# Altium schematic sheet PROC010B_CAN Interface.SchDoc: CAN Interface
size 431 x 279 mm; Date: Not shown in title block; ApprovedBy: Not shown in title block; CheckedBy: Not shown in title block; Author: Not shown in title block; CompanyName: Not shown in title block; DrawnBy: Adrian Ozer; Engineer: Not shown in title block; Organization: Not shown in title block; Address1: Not shown in title block; Address2: Not shown in title block; Address3: Not shown in title block; Address4: Not shown in title block; DocumentNumber: 14; Revision: Use project parameter SCH_Rev; SheetNumber: 14; SheetTotal: 16; PageSetup: Record=PageOptions|CenterHorizontal=True|CenterVertical=True|PrintScale=1.00|XCorrection=1.00|YCorrection=1.00|PrintKind=0|BorderSize=5000000|LeftOffset=0|BottomOffset=0|Orientation=2|PaperLength=1000|PaperWidth=1000|Scale=100|PaperSource=15|PrintQuality=600|MediaType=1|DitherType=10|PaperKind=Letter|PrintScaleMode=1; CurrentTime: Not shown in title block; CurrentDate: Not shown in title block; Time: Not shown in title block; DocumentFullPathAndName: Not shown in title block; DocumentName: Not shown in title block; ModifiedDate: Not shown in title block; ImagePath: Not shown in title block
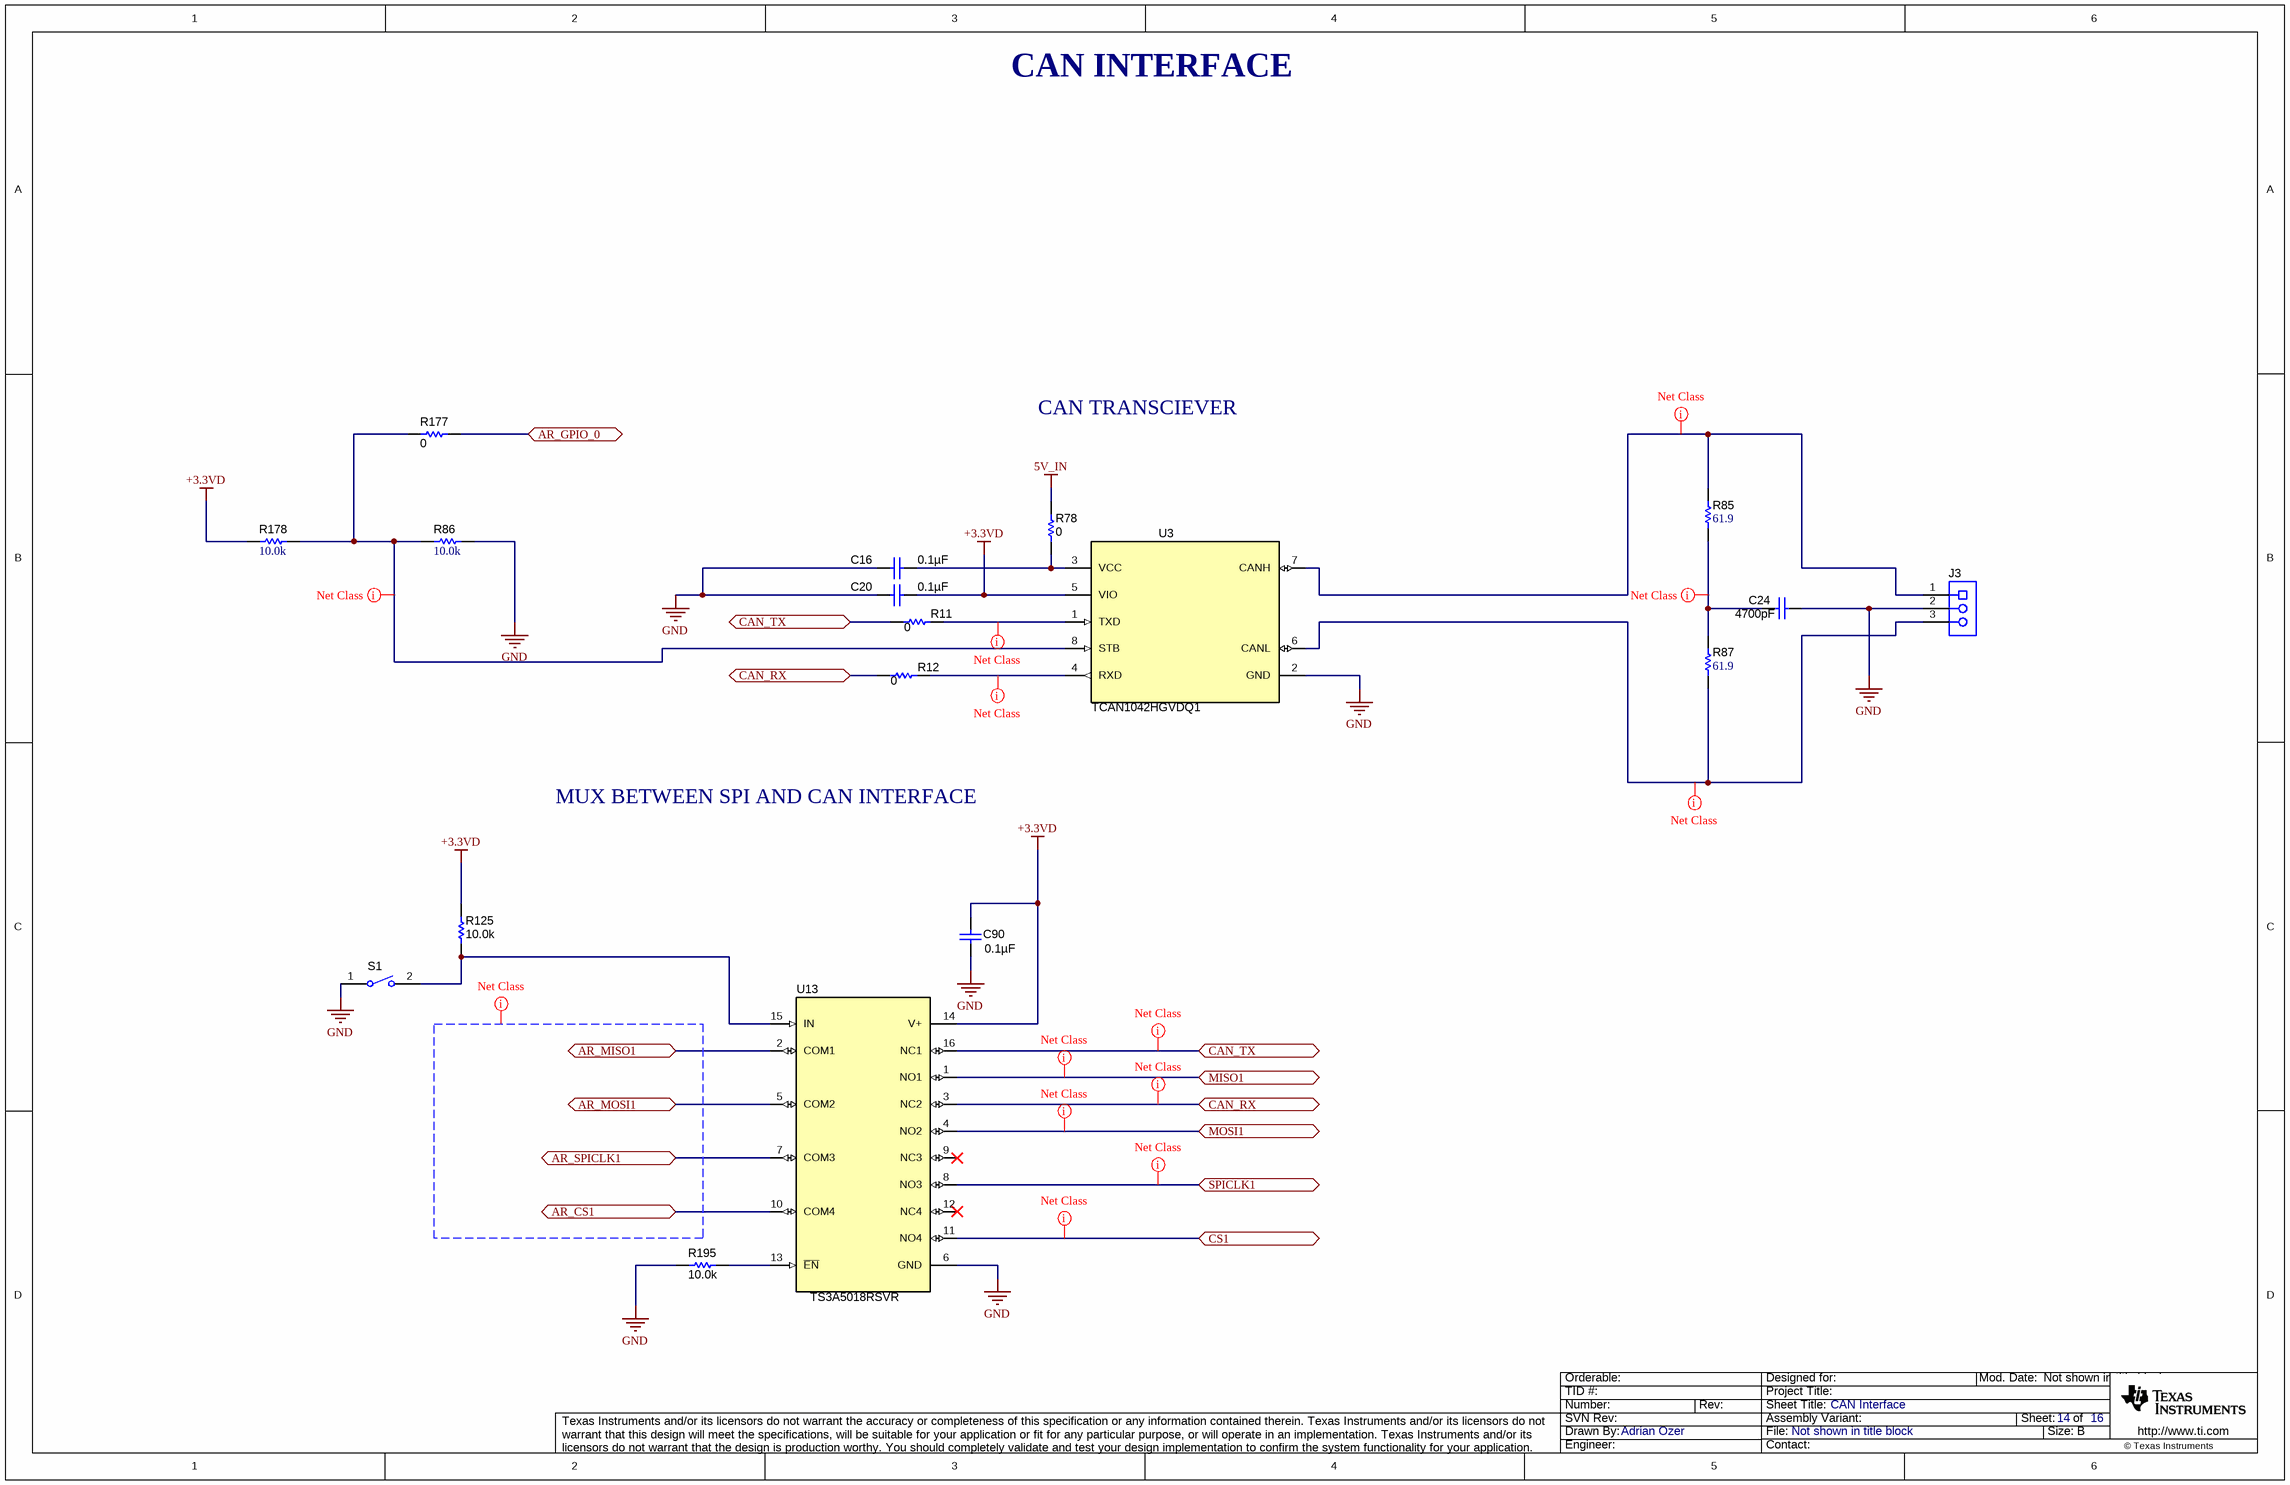
[diagram p0: PROC010B_CAN Interface.SchDoc]

## Parts
C16  ValueDisplayed: 0.1µF  [0402L]  (hidden comment: C0402C104K8RACTU)
C20  ValueDisplayed: 0.1µF  [0402L]  (hidden comment: C0402C104K8RACTU)
C24  ValueDisplayed: 4700pF  [0402L]  (hidden comment: C1005X7R1H472K050BA)
C90  ValueDisplayed: 0.1µF  [0402L]  (hidden comment: C0402C104K8RACTU)
J3  OSTTE030161  [On-Shore_OSTTE030161]  (value not drawn)
R11  ValueDisplayed: 0  [0402L]  (hidden comment: ERJ-2GE0R00X)
R12  ValueDisplayed: 0  [0402L]  (hidden comment: ERJ-2GE0R00X)
R78  ValueDisplayed: 0  [0402L]  (hidden comment: ERJ-2GE0R00X)
R85  ValueDisplayed: 61.9  [0402L]  (hidden comment: CRCW040261R9FKED)
R86  ValueDisplayed: 10.0k  [0402L]  (hidden comment: CRCW040210K0FKED)
R87  ValueDisplayed: 61.9  [0402L]  (hidden comment: CRCW040261R9FKED)
R125  ValueDisplayed: 10.0k  [0402L]  (hidden comment: CRCW040210K0FKED)
R177  ValueDisplayed: 0  [0402L]  (hidden comment: ERJ-2GE0R00X)
R178  ValueDisplayed: 10.0k  [0402L]  (hidden comment: CRCW040210K0FKED)
R195  ValueDisplayed: 10.0k  [0402L]  (hidden comment: CRCW040210K0FKED)
S1  CHS-01TB  [SW_CHS-01TB]  (value not drawn)
U3  TCAN1042HGVDQ1  [D0008A_L]
U13  TS3A5018RSVR  [RSV0016A]

## Ports
AR_CS1, AR_GPIO_0, AR_MISO1, AR_MOSI1, AR_SPICLK1, CAN_RX, CAN_TX, CS1, MISO1, MOSI1, SPICLK1

## Nets
5V_IN: R78.2
+3.3VD: C20.2 C90.2 R125.2 R178.1 U3.5(VIO) U13.14(V+)
GND: C16.1 C20.1 C24.1 C90.1 J3.2 R86.2 R195.2 S1.1 U3.2(GND) U13.6(GND)
AR_CS1: U13.10(COM4) ; port AR_CS1
AR_GPIO_0: R177.2 ; port AR_GPIO_0
AR_MISO1: U13.2(COM1) ; port AR_MISO1
AR_MOSI1: U13.5(COM2) ; port AR_MOSI1
AR_SPICLK1: U13.7(COM3) ; port AR_SPICLK1
CAN_RX: R12.1 U13.3(NC2) ; port CAN_RX
CAN_TX: R11.1 U13.16(NC1) ; port CAN_TX
CS1: U13.11(NO4) ; port CS1
MISO1: U13.1(NO1) ; port MISO1
MOSI1: U13.4(NO2) ; port MOSI1
SPICLK1: U13.8(NO3) ; port SPICLK1
NetC16_2: C16.2 R78.1 U3.3(VCC)
NetC24_2: C24.2 R85.1 R87.2
NetJ3_1: J3.1 R85.2 U3.7(CANH)
NetJ3_3: J3.3 R87.1 U3.6(CANL)
NetR11_2: R11.2 U3.1(TXD)
NetR12_2: R12.2 U3.4(RXD)
NetR86_1: R86.1 R177.1 R178.2 U3.8(STB)
NetR125_1: R125.1 S1.2 U13.15(IN)
NetR195_1: R195.1 U13.13(~{EN})

Not connected (* = marked no-connect by the designer): U13 9(NC3)* 12(NC4)*

## Layout directives
net class CAN: CAN_RX, CAN_TX, NetC24_2, NetJ3_1, NetJ3_3, NetR11_2, NetR12_2
net class GENERAL: NetR86_1
net class SPI: (no net found under the mark), CS1, MISO1, MOSI1, SPICLK1

## Notes on the sheet
- CAN INTERFACE
- CAN TRANSCIEVER
- MUX BETWEEN SPI AND CAN INTERFACE
- Drawn By:
- SVN Rev:
- Number:
- TID #:
- Orderable:
- Rev:
- Sheet Title:
- File:
- Project Title:
- Designed for:
- Assembly Variant:
- Mod. Date:
- Sheet:
- Size:
- of
- B
- http://www.ti.com
- Texas Instruments and/or its licensors do not warrant the accuracy or completeness of this specification or any information contained therein. Texas Instruments and/or its licensors do not warrant that this design will meet the specifications, will be suitable for your application or fit for any particular purpose, or will operate in an implementation. Texas Instruments and/or its licensors do not warrant that the design is production worthy. You should completely validate and test your design implementation to confirm the system functionality for your application.
- Engineer:
- Contact:
- © Texas Instruments

## Library data of the parts
C16 C20 C90 = CMP-0078241-1: CAP, CERM, 0.1 µF, 10 V,+/- 10%, X7R, 0402; Manufacturer: Kemet; TaMin_C: -55°C; Polarized: N; SizeAreaWB_mm2: 3; U/M: EA; Value: 0.1uF; TaMax_C: 125°C; SizeZ_mm: 0.6; SizeX_mm: 1; SizeY_mm: 0.5; Cap_Case: 0402; Value2: 10V; Cap_F: 100nF; AEC Category: Q200; ComponentLink1URL: https://content.kemet.com/datasheets/KEM_C1002_X7R_SMD.pdf; Supplier Part Number 2: 68X2393; Supplier 2: Newark; Supplier Part Number 3: 80-C0402C104K8R; TempCo: X7R; Supplier 3: Mouser; RoHS: Y; MountType: SMT; Supplier 1: Digi-Key; PackageReference: 0402; Tolerance_%: 10%; SizeArea_mm2: 0.5; CompType: Capacitor; PartNumber: C0402C104K8RACTU; AEC Qualified: N; VDC_V: 10V; ComponentLink1Description: Datasheet link; AEC Grade: N/A; Supplier Part Number 1: 399-3520-1-ND; Technology: Ceramic
C24 = CMP-0078221-1: CAP, CERM, 4700 pF, 50 V,+/- 10%, X7R, 0402; Manufacturer: TDK; TaMin_C: -55°C; Polarized: N; SizeAreaWB_mm2: 3; U/M: EA; Value: 4700pF; TaMax_C: 125°C; SizeZ_mm: 0.6; SizeX_mm: 1; SizeY_mm: 0.5; Cap_Case: 0402; Value2: 50V; Cap_F: 4.7nF; AEC Category: Q200; ComponentLink1URL: https://product.tdk.com/info/en/catalog/datasheets/mlcc_commercial_general_en.pdf; Supplier Part Number 2: 55T0075; Supplier 2: Newark; Supplier Part Number 3: 810-C1005X7R1H472K; TempCo: X7R; Supplier 3: Mouser; RoHS: Y; MountType: SMT; Supplier 1: Digi-Key; PackageReference: 0402; Tolerance_%: 10%; SizeArea_mm2: 0.5; CompType: Capacitor; PartNumber: C1005X7R1H472K050BA; AEC Qualified: N; VDC_V: 50V; ComponentLink1Description: Datasheet link; AEC Grade: N/A; Supplier Part Number 1: 445-1258-1-ND; Technology: Ceramic
J3 = CMP-0075352-1: Terminal Block, 3.5mm, 3x1, Tin, R/A, TH; Manufacturer: On-Shore Technology; CNHeader: False; Current_A: 10A; Green_Lifecycle: Not Set; Gender: Female; Cert_CSA: Y; Green_REACh: Incomplete; Voltage_V: 125V; Row_Count: 1; Pitch_mm: 3.5; CT: True; ComponentLink1URL: http://www.on-shore.com/wp-content/uploads/2015/09/osttexx0161.pdf; Publisher: Texas Instruments; Color: Blue; RoHS: Y; MountType: TH; Green_EU RoHS-2: Incomplete; Supplier 1: Digi-Key; Green_EU RoHS: Incomplete; PackageReference: Terminal Block, 3.5mm, 3x1, TH; PinCount: 3; CompType: Terminal Block; LatestRevisionDate: 2017-07-12; PartNumber: OSTTE030161; Orientation: R/A; ComponentLink1Description: Datasheet URL; Supplier Part Number 1: ED2636-ND; ContactFinish: Tin; Cert_UL: Y
R11 R12 R177 = CMP-0026992-2: RES, 0, 5%, 0.063 W, 0402; Manufacturer: Panasonic; Power_W: 63mW; TempCo: 600 ppm/C; Value_Code: 0000; U/M: EA; Value: 0; EIA_Code: E24; SizeX_mm: 1; SizeY_mm: 0.5; SizeZ_mm: 0.6; Value2: 0.063W; CompType: Resistor; VDC_V: 50V; AEC Category: Q200; INSTALATION: DNP; Supplier Part Number 2: 65T8307; Publisher: Texas Instruments; Supplier 2: Newark; Supplier Part Number 3: 667-ERJ-2GE0R00X; Supplier 3: Mouser; Published: 2008-06-26; RoHS: Y; Value1: 5%; MountType: SMT; Supplier 1: Digi-Key; PackageReference: 0402; Tolerance_%: 5%; Res_ohm: 0; SizeArea_mm2: 0.5; LatestRevisionDate: 2017-03-09; PartNumber: ERJ-2GE0R00X; AEC Qualified: ?; ComponentLink1Description: Datasheet link; Supplier Part Number 1: P0.0JCT-ND; Technology: Thick Film; ComponentLink1URL: http://www.panasonic.com/industrial/components/pdf/AOA0000CE1.pdf
R78 = CMP-0026992-2: RES, 0, 5%, 0.063 W, 0402; Manufacturer: Panasonic; Power_W: 63mW; TempCo: 600 ppm/C; Value_Code: 0000; U/M: EA; Value: 0; EIA_Code: E24; SizeX_mm: 1; SizeY_mm: 0.5; SizeZ_mm: 0.6; Value2: 0.063W; CompType: Resistor; VDC_V: 50V; AEC Category: Q200; Supplier Part Number 2: 65T8307; Publisher: Texas Instruments; Supplier 2: Newark; Supplier Part Number 3: 667-ERJ-2GE0R00X; Supplier 3: Mouser; Published: 2008-06-26; RoHS: Y; Value1: 5%; MountType: SMT; Supplier 1: Digi-Key; PackageReference: 0402; Tolerance_%: 5%; Res_ohm: 0; SizeArea_mm2: 0.5; LatestRevisionDate: 2017-03-09; PartNumber: ERJ-2GE0R00X; AEC Qualified: ?; ComponentLink1Description: Datasheet link; Supplier Part Number 1: P0.0JCT-ND; Technology: Thick Film; ComponentLink1URL: http://www.panasonic.com/industrial/components/pdf/AOA0000CE1.pdf
R85 R87 = CMP-0026491-2: RES, 61.9, 1%, 0.063 W, AEC-Q200 Grade 0, 0402; Manufacturer: Vishay-Dale; Power_W: 63mW; TempCo: 100 ppm/C; Value_Code: 61R9; Value: 61.9; EIA_Code: E96; SizeX_mm: 1; SizeY_mm: 0.5; SizeZ_mm: 0.6; Value2: 0.063W; AEC Qualified: Y; VDC_V: 50V; AEC Category: Q200; AEC Grade: 0; ComponentLink1URL: http://www.vishay.com/docs/20035/dcrcwe3.pdf; Supplier Part Number 2: 52K7198; Supplier 2: Newark; Supplier Part Number 3: 71-CRCW0402-61.9-E3; Supplier 3: Mouser; RoHS: E; Value1: 1%; MountType: SMT; Supplier 1: Digi-Key; PackageReference: 0402; Tolerance_%: 1%; Res_ohm: 61.9; SizeArea_mm2: 0.5; CompType: Resistor; PartNumber: CRCW040261R9FKED; ComponentLink1Description: Datasheet link; Supplier Part Number 1: 541-61.9LCT-ND; Technology: Thick Film
R86 R178 = CMP-0025958-3: RES, 10.0 k, 1%, 0.063 W, AEC-Q200 Grade 0, 0402; Manufacturer: Vishay-Dale; Power_W: 63mW; TempCo: 100 ppm/C; Value_Code: 10k0; Value: 10.0k; EIA_Code: E96; Res_ohm: 10k; SizeX_mm: 1; SizeY_mm: 0.5; SizeZ_mm: 0.6; Value2: 0.063W; AEC Qualified: Y; VDC_V: 50V; AEC Category: Q200; AEC Grade: 0; Supplier Part Number 2: 52K6595; Supplier 2: Newark; Supplier Part Number 3: 71-CRCW0402-10K-E3; Supplier 3: Mouser; RoHS: E; Value1: 1%; MountType: SMT; Supplier 1: Digi-Key; PackageReference: 0402; Tolerance_%: 1%; SizeArea_mm2: 0.5; CompType: Resistor; PartNumber: CRCW040210K0FKED; ComponentLink1Description: Datasheet link; Supplier Part Number 1: 541-10.0KLCT-ND; Technology: Thick Film; ComponentLink1URL: http://www.vishay.com/docs/20035/dcrcwe3.pdf
R125 R195 = CMP-0025958-2: RES, 10.0 k, 1%, 0.063 W, 0402; Manufacturer: Vishay-Dale; Power_W: 63mW; TempCo: 100 ppm/C; Value_Code: 10k0; U/M: EA; Value: 10.0k; EIA_Code: E96; Res_ohm: 10k; SizeX_mm: 1; SizeY_mm: 0.5; SizeZ_mm: 0.6; Value2: 0.063W; CompType: Resistor; VDC_V: 50V; AEC Category: Q200; Supplier Part Number 2: 52K6595; Publisher: Texas Instruments; Supplier 2: Newark; Supplier Part Number 3: 71-CRCW0402-10K-E3; Supplier 3: Mouser; Published: 2008-06-26; RoHS: Y; Value1: 1%; MountType: SMT; Supplier 1: Digi-Key; PackageReference: 0402; Tolerance_%: 1%; SizeArea_mm2: 0.5; LatestRevisionDate: 2017-03-09; PartNumber: CRCW040210K0FKED; AEC Qualified: ?; ComponentLink1Description: Datasheet link; Supplier Part Number 1: 541-10.0KLCT-ND; Technology: Thick Film; ComponentLink1URL: http://www.vishay.com/docs/20035/dcrcwe3.pdf
S1 = CMP-0002163-2: Switch, Slide, SPST, Top Slide, SMT; Manufacturer: Copal Electronics; CurrentRating_mA: 100A; SwitchFunction: Off-On; VDC_V: 6V; PositionCount: 1; ComponentLink1Description: Datasheet URL; LatestRevisionDate: 2017-03-09; PackageReference: Switch, Single Top Slide, 2.5x8x2.5mm; Publisher: Texas Instruments; Supplier 1: Digi-Key; Supplier Part Number 1: 563-1004-1-ND; MountType: SMT; Circuit: SPST; Orientation: Top Actuated; PartNumber: CHS-01TB; CompType: Switch; RoHS: Y; ComponentLink1URL: http://copal-electronics.info/en/CopalElectronics/switches_en/chs_en.pdf
U3 = CMP-0075992-1: Automotive Fault Protected CAN Transceiver With Flexible Data-Rate, D0008A (SOIC-8); Manufacturer: Texas Instruments; Alternate PartNumber: TCAN1042HGVDRQ1; SizeAreaWB_mm2: 56.58; SizeArea_mm2: 30.38; SizeZ_mm: 1.75; SizeY_mm: 6.2; U/M: EA; CompType: IC; SizeX_mm: 4.9; ComponentLink1Description: Datasheet Link; RoHS: Y; PackageReference: D0008A; PartNumber: TCAN1042HGVDQ1; Publisher: Texas Instruments; PackageDescription: SOIC-8; Alternate Manufacturer: Texas Instruments; ComponentLink1URL: http://www.ti.com/lit/ds/symlink/tcan1042-q1.pdf; LatestRevisionDate: 2017-06-09; MountType: SMT
U13 = CMP-0067415-1: 10-Ohm Quad SPDT Analog Switch, RSV0016A (UQFN-16); Alternate Manufacturer: Texas Instruments; SizeAreaWB_mm2: 10.08; U/M: EA; SizeZ_mm: 0.55; SizeX_mm: 1.8; SizeY_mm: 2.6; SizeArea_mm2: 4.68; CompType: IC; ComponentLink1URL: http://www.ti.com/lit/ds/symlink/ts3a5018.pdf; Publisher: Texas Instruments; PackageDescription: UQFN-16; RoHS: Y; Footprint Path 6: C:\AltiumLibraries\Footprints\TI\.PcbLib; MountType: SMT; Manufacturer: Texas Instruments; PackageReference: RSV0016A; LatestRevisionDate: 2017-06-09; PartNumber: TS3A5018RSVR; ComponentLink1Description: Datasheet Link